# Altium schematic sheet Power Suppy Schematic.SchDoc
size A4; SheetNumber: 2; SheetTotal: 3
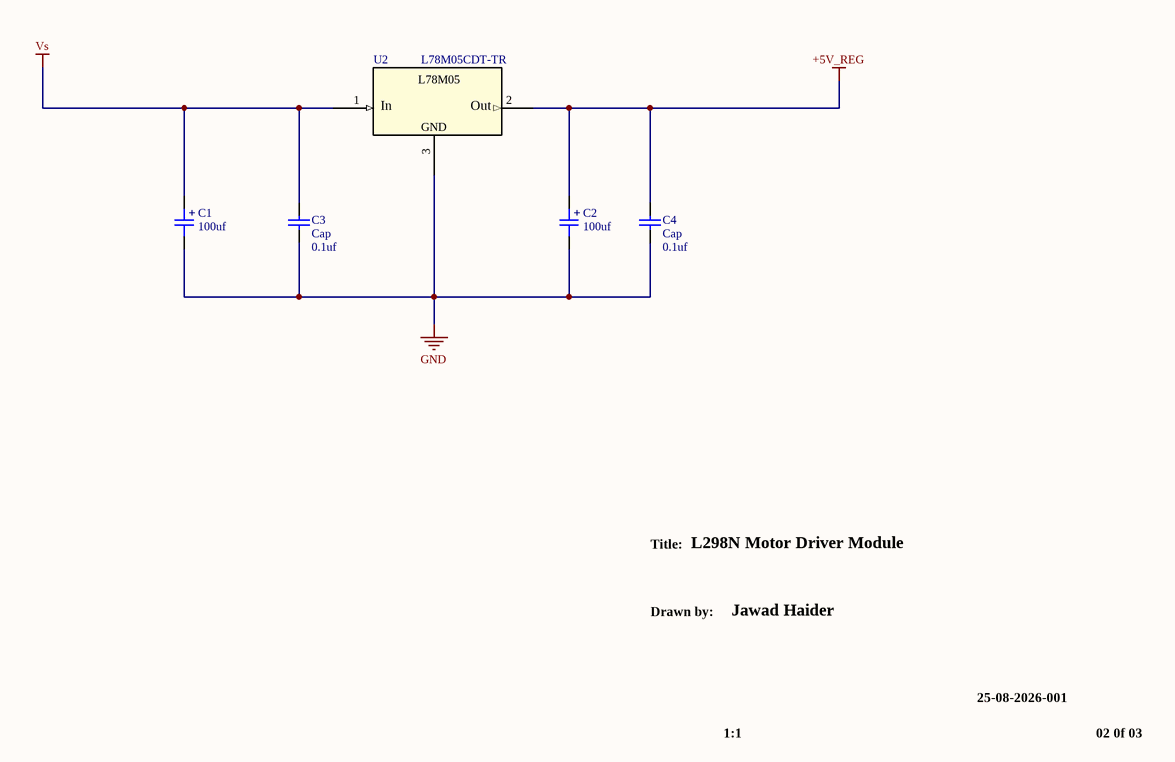
[diagram p0: Power Suppy Schematic.SchDoc]

## Parts
C1  100uf  [CAP_AE_SMD_D6MM3_H5M55]
C2  100uf  [CAP_AE_SMD_D6MM3_H5M55]
C3  Cap  value 0.1uf  [CAP_0603]
C4  Cap  value 0.1uf  [CAP_0603]
U2  L78M05CDT-TR  [DPAK_STM]

## Nets
+5V_REG: C2.1 C4.2 U2.2(OUTPUT)
GND: C1.2 C2.2 C3.1 C4.1 U2.3(GROUND)
Vs: C1.1 C3.2 U2.1(INPUT)

## Notes on the sheet
- Title:
- L298N Motor Driver Module
- Drawn by:
- Jawad Haider
- 25-08-2026-001
- 1:1
- 02 0f 03
- (in symbol CAP_ALEL_6.3x5.5) +
- (in symbol L78M05CDT-TR) L78M05; In; Out; GND

## Library data of the parts
C1 C2 = CAP_ALEL_6.3x5.5: Capacitor SMD Aluminium Electrolytic 6.3mm Diameter 5.5mm Height; Manufacturer: *; Manufacturer Part Number: *; Distributor Link: *; LCSC: *
C3 C4 = Cap: Capacitor; Published: 8-Jun-2000; LatestRevisionDate: 17-Jul-2002; LatestRevisionNote: Re-released for DXP Platform.; PackageReference: RAD-0.3; Publisher: Altium Limited; PackageDescription: Radial Cap, Thru-Hole; 2 Leads; 0.3 in Pin Spacing
U2 = L78M05CDT-TR: Precision 500 mA regulators; Manufacturer_Name: STMicroelectronics; Copyright: Copyright (C) 2025 Ultra Librarian. All rights reserved.; Manufacturer_Part_Number: L78M05CDT-TR; RefDes: RefDes; Type: Type